# EAGLE schematic bigboard (EAGLE 6.4)
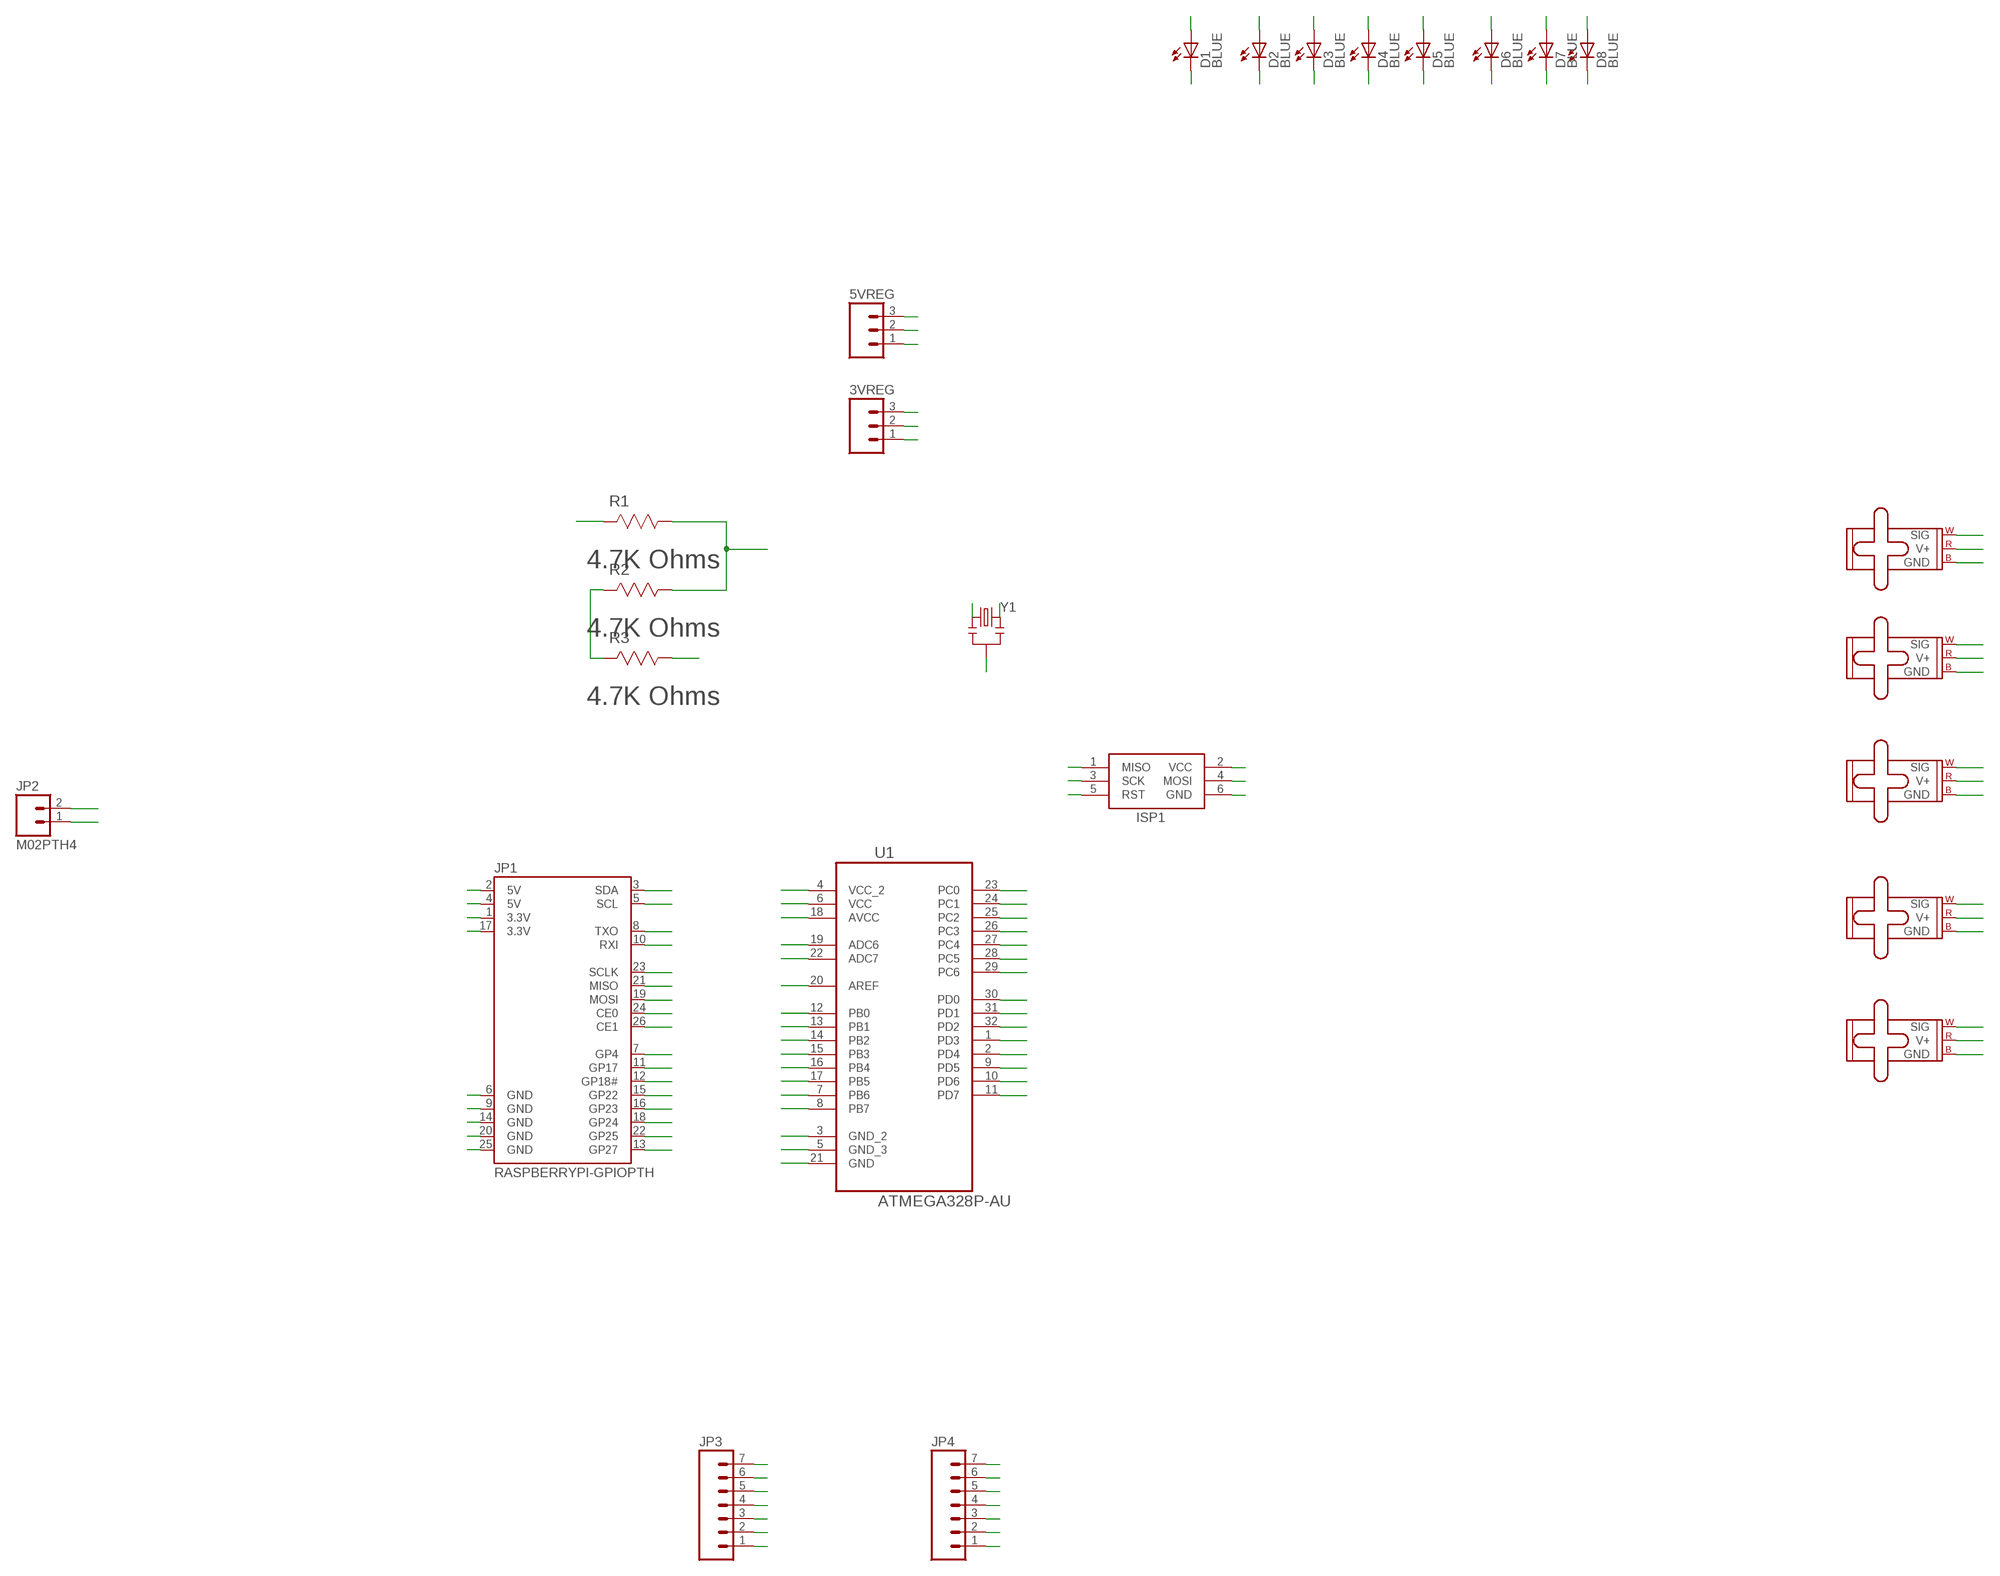
[diagram p0: schematic, sheet 1]

## Parts
3VREG  M03PTH  [1X03]
5VREG  M03PTH  [1X03]
D1  BLUE  LED-BLUE0603  [LED-0603]
D2  BLUE  LED-BLUE0603  [LED-0603]
D3  BLUE  LED-BLUE0603  [LED-0603]
D4  BLUE  LED-BLUE0603  [LED-0603]
D5  BLUE  LED-BLUE0603  [LED-0603]
D6  BLUE  LED-BLUE0603  [LED-0603]
D7  BLUE  LED-BLUE0603  [LED-0603]
D8  BLUE  LED-BLUE0603  [LED-0603]
ISP1  AVRISP-6  [AVRISP]
JP1  RASPBERRYPI-GPIOPTH  [2X13-SHROUDED]
JP2  M02PTH4  [1X02_XTRA_BIG]
JP3  M07  [1X07]
JP4  M07  [1X07]
M1  SMALL_SERVO  [1X03]
M2  SMALL_SERVO  [1X03]
M3  SMALL_SERVO  [1X03]
M4  SMALL_SERVO  [1X03]
M5  SMALL_SERVO  [1X03]
R1  4.7K Ohms  CRCW06034K70FKEA  [RESC1608X60N]
R2  4.7K Ohms  CRCW06034K70FKEA  [RESC1608X60N]
R3  4.7K Ohms  CRCW06034K70FKEA  [RESC1608X60N]
U1  ATMEGA328P-AU  [QFP80P900X900X120-32N]
Y1  RESONATORPTH  [RESONATOR-PTH]

## Nets
3V: 3VREG.1 D8.A JP1.1(3.3V) JP1.17(3.3V)
5V: 3VREG.3 5VREG.1 ISP1.2(VCC) JP1.2(5V) JP1.4(5V) M1.2(V+) M2.2(V+) M3.2(V+) M4.2(V+) M5.2(V+) U1.4(VCC_2) U1.6(VCC) U1.18(AVCC)
A0: JP3.1 U1.23(PC0)
A1: JP3.2 U1.24(PC1)
A2: JP3.3 U1.25(PC2)
A3: JP3.4 U1.26(PC3)
A4: JP3.5 U1.27(PC4)
A5: JP3.6 U1.28(PC5)
ARX: JP1.8(TXO) U1.30(PD0)
ATX: R1.1(R1) R2.1(R1) U1.31(PD1)
D2: M1.1(SIG) U1.32(PD2)
D3: M2.1(SIG) U1.1(PD3)
D4: M3.1(SIG) U1.2(PD4)
D5: M4.1(SIG) U1.9(PD5)
D6: M5.1(SIG) U1.10(PD6)
D7: D1.A JP4.1 U1.11(PD7)
D8: D2.A JP4.2 U1.12(PB0)
D9: D3.A JP4.3 U1.13(PB1)
D10: D4.A JP4.4 U1.14(PB2)
D11: D5.A ISP1.4(MOSI) JP4.5 U1.15(PB3)
D12: D6.A ISP1.1(MISO) JP4.6 U1.16(PB4)
D13: D7.A ISP1.3(SCK) JP4.7 U1.17(PB5)
GND: 3VREG.2 5VREG.2 D1.C D2.C D3.C D4.C D5.C D6.C D7.C D8.C ISP1.6(GND) JP1.6(GND) JP1.9(GND) JP1.14(GND) JP1.20(GND) JP1.25(GND) JP2.2 JP3.7 M1.3(GND) M2.3(GND) M3.3(GND) M4.3(GND) M5.3(GND) R3.1(R1) U1.3(GND_2) U1.5(GND_3) U1.21(GND) Y1.2
N$4: U1.19(ADC6)
N$5: U1.22(ADC7)
N$6: U1.20(AREF)
N$15: R2.2(R2) R3.2(R2)
N$33: JP1.3(SDA)
N$34: JP1.5(SCL)
N$37: JP1.23(SCLK)
N$38: JP1.21(MISO)
N$39: JP1.19(MOSI)
N$40: JP1.24(CE0)
N$41: JP1.26(CE1)
N$42: JP1.7(GP4)
N$43: JP1.11(GP17)
N$44: JP1.12(GP18#)
N$45: JP1.15(GP22)
N$46: JP1.16(GP23)
N$47: JP1.18(GP24)
N$48: JP1.22(GP25)
N$49: JP1.13(GP27)
RESET: ISP1.5(RST) U1.29(PC6)
RRX: JP1.10(RXI) R1.2(R2)
VIN: 5VREG.3 JP2.1
XTAL1: U1.7(PB6) Y1.1
XTAL2: U1.8(PB7) Y1.3

## Library data of the parts
3VREG 5VREG = SparkFun-Connectors:M03: Header 3 Standard 3-pin 0.1" header. Use with straight break away headers (SKU : PRT-00116), right angle break away headers (PRT-00553), swiss pins (PRT-00743), machine pins (PRT-00117), and female headers (PRT-00115). Molex polarized connector foot print use with SKU : PRT-08232 with associated crimp pins and housings.
D1-D8 = SparkFun-LED:LED-BLUE: Blue LEDs for production use Various blue LEDs stocked by SparkFun production 0603 - DIO-08575 Rebel - DIO-09553 1206 - DIO-09911; PROD_ID: DIO-08575
ISP1 = adafruit:AVRISP: AVR ISP HEADER Standard 6 pin header for AVR programming
JP1 = SparkFun-Boards:RASPBERRYPI-GPIO: RASPBERRY PI I/O HEADER As defined for the Revistion 2 Pi.; DIST: sparkfun; DIST_ID: PRT-11490
JP2 = SparkFun-Connectors:M02: Standard 2-pin 0.1" header. Use with - straight break away headers ( PRT-00116) - right angle break away headers (PRT-00553) - swiss pins (PRT-00743) - machine pins (PRT-00117) - female headers (PRT-00115) Molex polarized connector foot print use with: PRT-08233 with associated crimp pins and housings. 2.54_SCREWTERM for use with PRT-10571. 3.5mm Screw Terminal footprints for PRT-08084 5mm Screw Terminal footprints for use with PRT-08433
JP3 JP4 = SparkFun-Connectors:M07: Header 7 Standard 7-pin 0.1" header. Use with straight break away headers (SKU : PRT-00116), right angle break away headers (PRT-00553), swiss pins (PRT-00743), machine pins (PRT-00117), and female headers (PRT-00115). NOTES ON THE VARIANTS LOCK and LOCK_LONGPADS... This footprint was designed to help hold the alignment of a through-hole component (i.e. 7-pin header) while soldering it into place. You may notice that each hole has been shifted either up or down by 0.005 of an inch from it's more standard position (which is usually a perfectly straight line). This slight alteration caused the pins (the squares in the middle) to touch the edges of the holes. Because they are alternating, it causes a "brace" to hold the header in place. 0.005 has proven to be the perfect amount of "off-center" position when using our standard breakaway headers. Although looks a little odd when you look at the bare footprint, once you have a header in there, the alteration is very hard to notice. Also, if you push a header all the way into place, it is covered up entirely on the bottom side. This idea of altering the position of holes to aid alignment will be further integrated into the Sparkfun Library for other footprints. It can help hold any component with 3 or more connection pins.
M1-M5 = SparkFun-Electromechanical:SMALL_SERVO: Small servo motor This is the small servo used in the SIK. SKU: ROB-09065
R1-R3 = MoskLib:CRCW06034K70FKEA: RESISTOR, 0603; MPN: CRCW06034K70FKEA; OC_FARNELL: 1469807; OC_NEWARK: 52K8494; SUPPLIER: Vishay; TOLERANCE: ± 1.0 %; WATTAGE: 0.1W
U1 = MoskLib:ATMEGA328P-AU: 8-bit Microcontroller with In-System Programmable Flash; MPN: ATMEGA328P-AU; OC_FARNELL: 1715486; OC_NEWARK: 68T2935; PACKAGE: TQFP-32; SUPPLIER: Atmel
Y1 = SparkFun-FreqCtrl:RESONATOR: Resonator Small SMD resonator. Used, eg, on the Arduino Pro/ Pro Mini boards. 8MHz- XTAL-08895 16MHz- XTAL-08900